# EAGLE design JeffreyBJT-optocoupler (EAGLE 6.4)
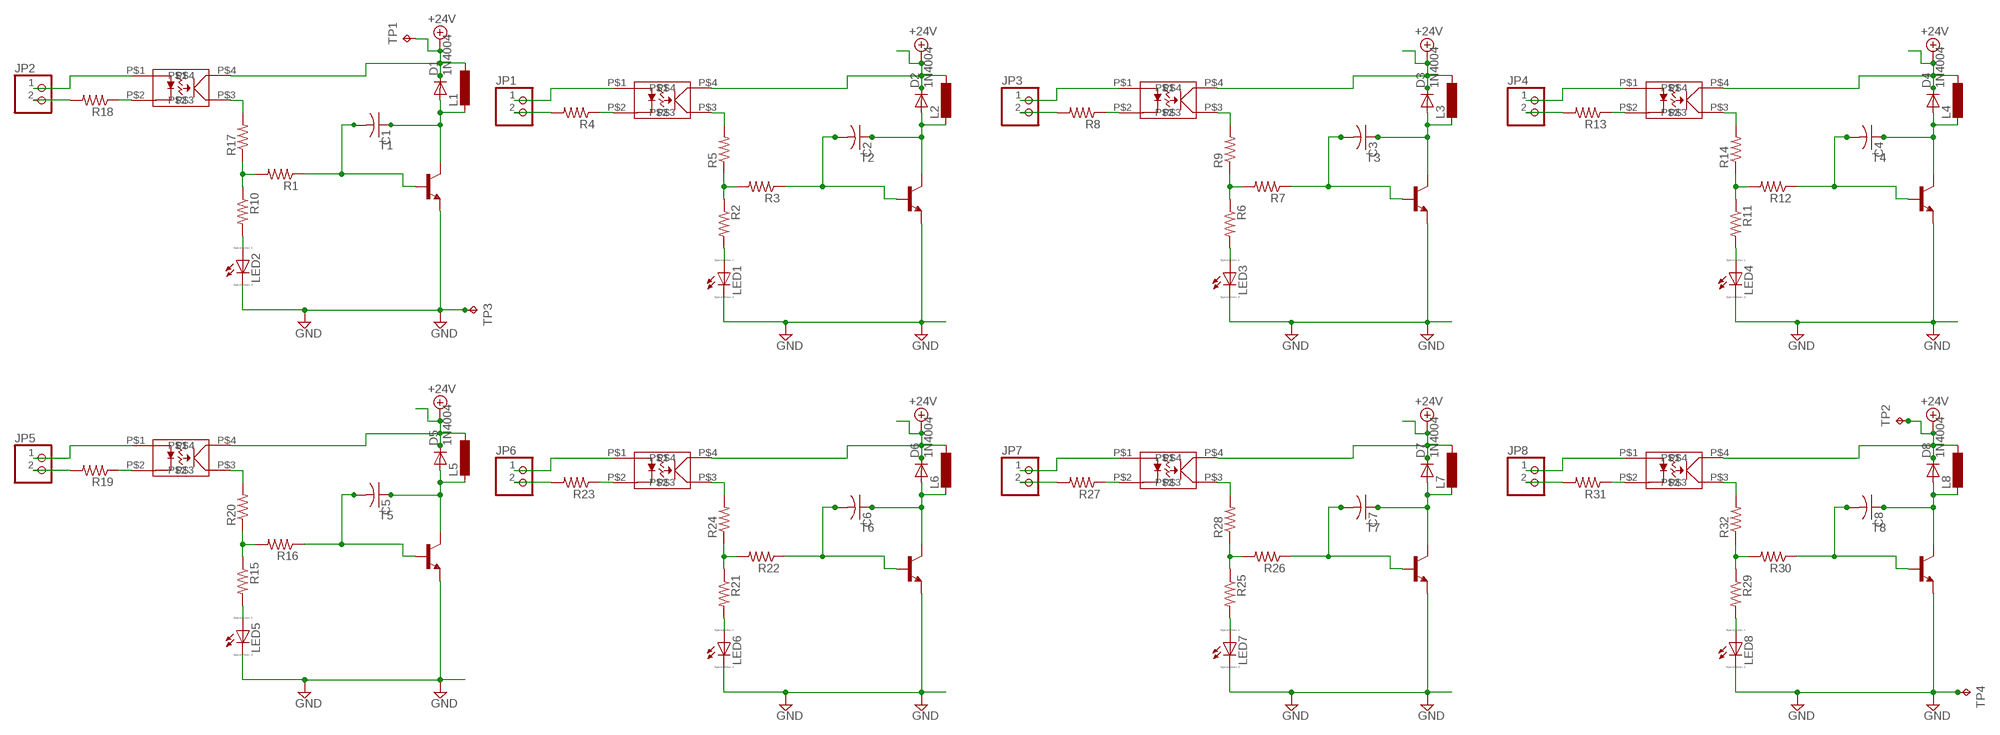
[diagram p0: schematic, sheet 1]

## Parts
C1  C-US050-024X044  [C050-024X044]
C2  C-US050-024X044  [C050-024X044]
C3  C-US050-024X044  [C050-024X044]
C4  C-US050-024X044  [C050-024X044]
C5  C-US050-024X044  [C050-024X044]
C6  C-US050-024X044  [C050-024X044]
C7  C-US050-024X044  [C050-024X044]
C8  C-US050-024X044  [C050-024X044]
D1  1N4004  [DO41-10]
D2  1N4004  [DO41-10]
D3  1N4004  [DO41-10]
D4  1N4004  [DO41-10]
D5  1N4004  [DO41-10]
D6  1N4004  [DO41-10]
D7  1N4004  [DO41-10]
D8  1N4004  [DO41-10]
JP1  PINHD-1X2  [1X02]
JP2  PINHD-1X2  [1X02]
JP3  PINHD-1X2  [1X02]
JP4  PINHD-1X2  [1X02]
JP5  PINHD-1X2  [1X02]
JP6  PINHD-1X2  [1X02]
JP7  PINHD-1X2  [1X02]
JP8  PINHD-1X2  [1X02]
L1  L-EU0207/10  [0207/10]
L2  L-EU0207/10  [0207/10]
L3  L-EU0207/10  [0207/10]
L4  L-EU0207/10  [0207/10]
L5  L-EU0207/10  [0207/10]
L6  L-EU0207/10  [0207/10]
L7  L-EU0207/10  [0207/10]
L8  L-EU0207/10  [0207/10]
LED1  LED_ELD260  [LED_LD260]
LED2  LED_ELD260  [LED_LD260]
LED3  LED_ELD260  [LED_LD260]
LED4  LED_ELD260  [LED_LD260]
LED5  LED_ELD260  [LED_LD260]
LED6  LED_ELD260  [LED_LD260]
LED7  LED_ELD260  [LED_LD260]
LED8  LED_ELD260  [LED_LD260]
R1  R-US_0207/2V  [0207/2V]
R2  R-US_0207/2V  [0207/2V]
R3  R-US_0207/2V  [0207/2V]
R4  R-US_0207/2V  [0207/2V]
R5  R-US_0207/7  [0207/7]
R6  R-US_0207/2V  [0207/2V]
R7  R-US_0207/2V  [0207/2V]
R8  R-US_0207/2V  [0207/2V]
R9  R-US_0207/7  [0207/7]
R10  R-US_0207/2V  [0207/2V]
R11  R-US_0207/2V  [0207/2V]
R12  R-US_0207/2V  [0207/2V]
R13  R-US_0207/2V  [0207/2V]
R14  R-US_0207/7  [0207/7]
R15  R-US_0207/2V  [0207/2V]
R16  R-US_0207/2V  [0207/2V]
R17  R-US_0207/7  [0207/7]
R18  R-US_0207/2V  [0207/2V]
R19  R-US_0207/2V  [0207/2V]
R20  R-US_0207/7  [0207/7]
R21  R-US_0207/2V  [0207/2V]
R22  R-US_0207/2V  [0207/2V]
R23  R-US_0207/2V  [0207/2V]
R24  R-US_0207/7  [0207/7]
R25  R-US_0207/2V  [0207/2V]
R26  R-US_0207/2V  [0207/2V]
R27  R-US_0207/2V  [0207/2V]
R28  R-US_0207/7  [0207/7]
R29  R-US_0207/2V  [0207/2V]
R30  R-US_0207/2V  [0207/2V]
R31  R-US_0207/2V  [0207/2V]
R32  R-US_0207/7  [0207/7]
T1  -NPN-TO220V  [TO220V]
T2  -NPN-TO220V  [TO220V]
T3  -NPN-TO220V  [TO220V]
T4  -NPN-TO220V  [TO220V]
T5  -NPN-TO220V  [TO220V]
T6  -NPN-TO220V  [TO220V]
T7  -NPN-TO220V  [TO220V]
T8  -NPN-TO220V  [TO220V]
TP1  TPPAD1-13Y  [P1-13Y]
TP2  TPPAD1-13Y  [P1-13Y]
TP3  TPPAD1-13Y  [P1-13Y]
TP4  TPPAD1-13Y  [P1-13Y]
U$1  PS2501_TRU  [PS2501_TRU]
U$2  PS2501_TRU  [PS2501_TRU]
U$3  PS2501_TRU  [PS2501_TRU]
U$4  PS2501_TRU  [PS2501_TRU]
U$5  PS2501_TRU  [PS2501_TRU]
U$6  PS2501_TRU  [PS2501_TRU]
U$7  PS2501_TRU  [PS2501_TRU]
U$8  PS2501_TRU  [PS2501_TRU]

## Nets
+24V [SUPPLY]: D1.C D2.C D3.C D4.C D5.C D6.C D7.C D8.C L1.1 L2.1 L3.1 L4.1 L5.1 L6.1 L7.1 L8.1 TP1.TP TP2.TP U$1.P$4 U$2.P$4 U$3.P$4 U$4.P$4 U$5.P$4 U$6.P$4 U$7.P$4 U$8.P$4
GND [GND]: LED1.K(C) LED2.K(C) LED3.K(C) LED4.K(C) LED5.K(C) LED6.K(C) LED7.K(C) LED8.K(C) T1.3(E) T2.3(E) T3.3(E) T4.3(E) T5.3(E) T6.3(E) T7.3(E) T8.3(E) TP3.TP TP4.TP
N$1: C1.1 D1.A L1.2 T1.2(C)
N$2: C1.2 R1.1 T1.1(B)
N$3: R1.2 R10.1 R17.1
N$4: C2.1 D2.A L2.2 T2.2(C)
N$6: C2.2 R3.1 T2.1(B)
N$7: R2.1 R3.2 R5.1
N$9: R5.2 U$2.P$3
N$10: R4.1 U$2.P$2
N$11: JP1.2 R4.2
N$12: JP1.1 U$2.P$1
N$13: LED1.A R2.2
N$14: C3.1 D3.A L3.2 T3.2(C)
N$15: C3.2 R7.1 T3.1(B)
N$16: R6.1 R7.2 R9.1
N$18: R9.2 U$3.P$3
N$19: R8.1 U$3.P$2
N$20: JP3.2 R8.2
N$21: JP3.1 U$3.P$1
N$22: LED3.A R6.2
N$23: C4.1 D4.A L4.2 T4.2(C)
N$24: C4.2 R12.1 T4.1(B)
N$25: R11.1 R12.2 R14.1
N$26: LED2.A R10.2
N$28: R14.2 U$4.P$3
N$29: R13.1 U$4.P$2
N$30: R17.2 U$1.P$3
N$31: JP2.2 R18.2
N$32: JP4.2 R13.2
N$33: JP2.1 U$1.P$1
N$34: JP4.1 U$4.P$1
N$35: R18.1 U$1.P$2
N$36: LED4.A R11.2
N$37: C5.1 D5.A L5.2 T5.2(C)
N$38: C5.2 R16.1 T5.1(B)
N$39: R15.1 R16.2 R20.1
N$41: R20.2 U$5.P$3
N$42: R19.1 U$5.P$2
N$43: JP5.2 R19.2
N$44: JP5.1 U$5.P$1
N$45: LED5.A R15.2
N$46: C6.1 D6.A L6.2 T6.2(C)
N$47: C6.2 R22.1 T6.1(B)
N$48: R21.1 R22.2 R24.1
N$50: R24.2 U$6.P$3
N$51: R23.1 U$6.P$2
N$52: JP6.2 R23.2
N$53: JP6.1 U$6.P$1
N$54: LED6.A R21.2
N$55: C7.1 D7.A L7.2 T7.2(C)
N$56: C7.2 R26.1 T7.1(B)
N$57: R25.1 R26.2 R28.1
N$59: R28.2 U$7.P$3
N$60: R27.1 U$7.P$2
N$61: JP7.2 R27.2
N$62: JP7.1 U$7.P$1
N$63: LED7.A R25.2
N$64: C8.1 D8.A L8.2 T8.2(C)
N$65: C8.2 R30.1 T8.1(B)
N$66: R29.1 R30.2 R32.1
N$68: R32.2 U$8.P$3
N$69: R31.1 U$8.P$2
N$70: JP8.2 R31.2
N$71: JP8.1 U$8.P$1
N$72: LED8.A R29.2

## Library data of the parts
C1-C8 = rcl:C-US: CAPACITOR, American symbol
D1-D8 = diode:1N4004: DIODE general purpose rectifier, 1 A
JP1-JP8 = pinhead:PINHD-1X2: PIN HEADER
L1-L8 = rcl:L-EU: INDUCTOR, European symbol
LED1-LED8 = eagle-ltspice:LED_E: LED Source: http://www.osram.convergy.de Source: www.luxeon.com Source: www.kingbright.com; SPICEMODEL: NONE; SPICEPREFIX: D; SPICETYPE: diode
R1-R32 = rcl:R-US_: RESISTOR, American symbol
T1-T8 = transistor:*-NPN-: NPN Transistror BF959 corrected 2008.03.06
TP1-TP4 = testpad:TP: Test pad
U$1-U$8 = OpticalCoupler:PS2501_TRU

## Net classes
2 GND: width 1.143 mm
3 SUPPLY: width 1.143 mm

## Board
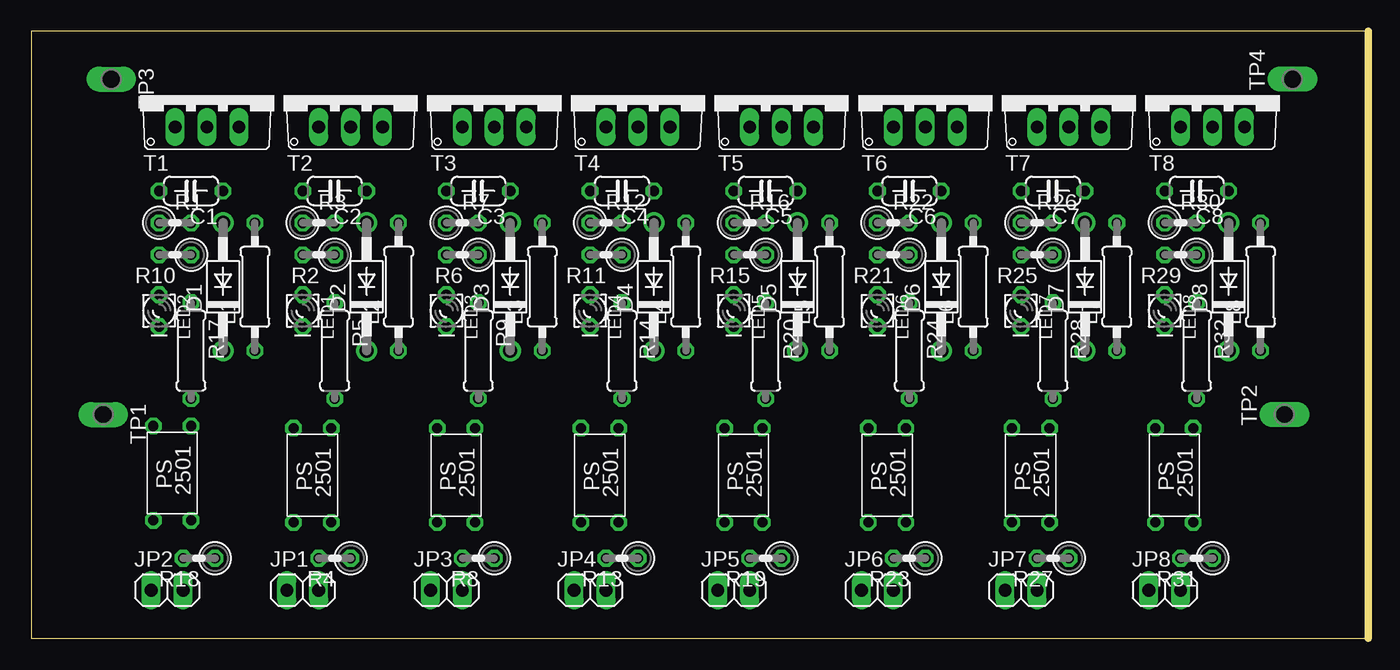
[diagram p1: board, top side]
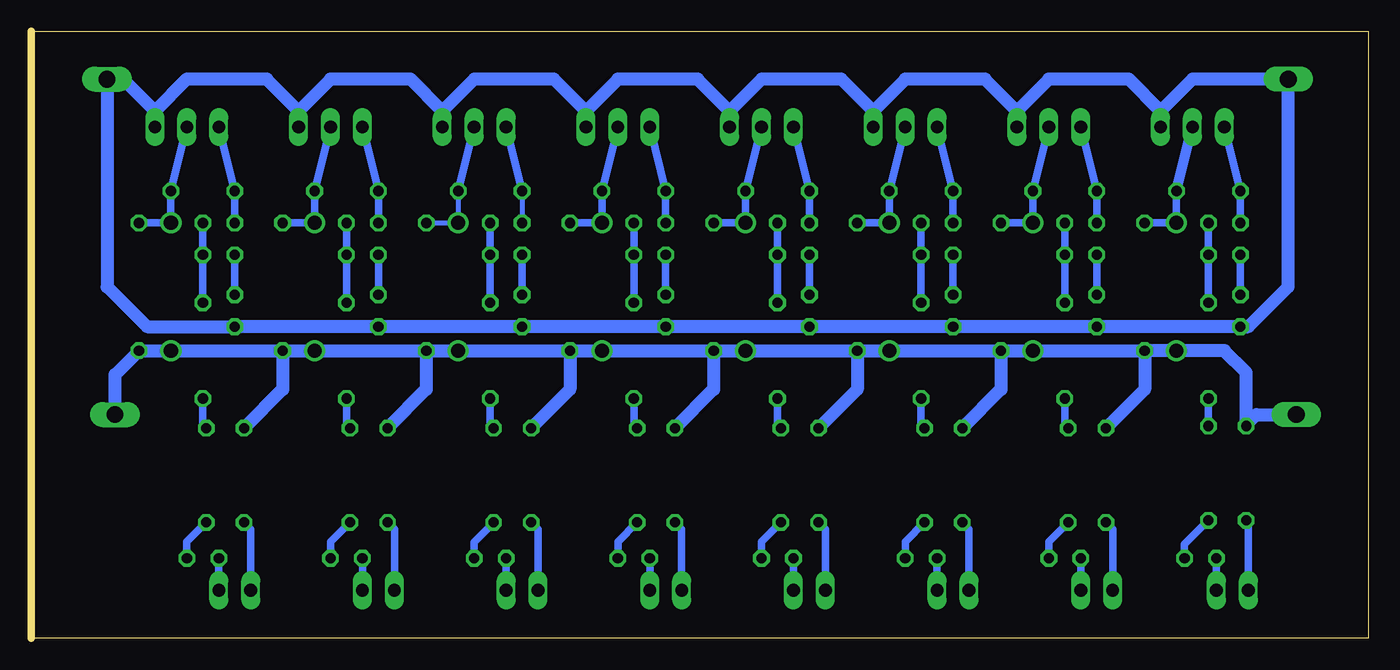
[diagram p2: board, bottom side, seen from below]

Size 106.35 x 48.25 mm. Coordinates in mm from the lower left corner, seen from the top.
Outline: 0,0 106.35,0 106.35,48.25 0,48.25 0,0
Copper layers (1*16): Top 0.035mm / dielectric 1.5mm / Bottom 0.035mm
Design rules "default": minimum track width 10mil, minimum drill 24mil, track to track 8mil, track to pad 8mil, pad to pad 8mil, via to via 8mil, smd to smd 8mil, copper to edge 40mil, drill to drill 8mil, minimum pad ring 10mil, minimum via ring 8mil, stop-mask expansion 4mil, vias tented up to drill 0mil, thermal gap 10mil

### Footprints (pad centres in the part's own frame; a part is rotated, then mirrored left to right if it is on the bottom)
C050-024X044 = drill 0.813 octagon: 1 -2.54,0; 2 2.54,0
DO41-10 = drill 1.118: A 5.08,0; C -5.08,0
1X02 = drill 1.016 long: 1 -1.27,0; 2 1.27,0
0207/10 = drill 0.813 octagon: 1 -5.08,0; 2 5.08,0
LED_LD260 = drill 0.813 octagon: A -1.27,0; K 1.27,0
0207/2V = drill 0.813 octagon: 1 -1.27,0; 2 1.27,0
0207/7 = drill 0.813 octagon: 1 -3.81,0; 2 3.81,0
TO220V = drill 1.016 long: 1 -2.54,-2.54; 2 0,-2.54; 3 2.54,-2.54
P1-13Y = drill 1.321 pad 1.905 long: TP 0,0
PS2501_TRU = drill 0.8 octagon: P$1 -3.5,2; P$2 -3.5,-1; P$3 4,-1; P$4 4,2

### Placement (x,y rotation side)
C1  12.7,35.56 180 top
C2  24.13,35.56 180 top
C3  35.56,35.56 180 top
C4  46.99,35.56 180 top
C5  58.42,35.56 180 top
C6  69.85,35.56 180 top
C7  81.28,35.56 180 top
C8  92.71,35.56 180 top
D1  15.24,27.94 90 top
D2  26.67,27.94 90 top
D3  38.1,27.94 90 top
D4  49.53,27.94 90 top
D5  60.96,27.94 90 top
D6  72.39,27.94 90 top
D7  83.82,27.94 90 top
D8  95.25,27.94 90 top
JP1  21.59,3.81 0 top
JP2  10.79,3.81 0 top
JP3  33.02,3.81 0 top
JP4  44.45,3.81 0 top
JP5  55.88,3.81 0 top
JP6  67.31,3.81 0 top
JP7  78.74,3.81 0 top
JP8  90.17,3.81 0 top
L1  17.78,27.94 90 top
L2  29.21,27.94 90 top
L3  40.64,27.94 90 top
L4  52.07,27.94 90 top
L5  63.5,27.94 90 top
L6  74.93,27.94 90 top
L7  86.36,27.94 90 top
L8  97.79,27.94 90 top
LED1  21.59,26.04 270 top
LED2  10.16,26.04 270 top
LED3  33.02,26.04 270 top
LED4  44.45,26.04 270 top
LED5  55.88,26.04 270 top
LED6  67.31,26.04 270 top
LED7  78.74,26.04 270 top
LED8  90.17,26.04 270 top
R1  11.43,33.02 0 top
R2  22.86,30.48 180 top
R3  22.86,33.02 0 top
R4  24.13,6.35 180 top
R5  24.13,22.86 270 top
R6  34.29,30.48 180 top
R7  34.29,33.02 0 top
R8  35.56,6.35 180 top
R9  35.56,22.86 270 top
R10  11.43,30.48 180 top
R11  45.72,30.48 180 top
R12  45.72,33.02 0 top
R13  46.99,6.35 180 top
R14  46.99,22.86 270 top
R15  57.15,30.48 180 top
R16  57.15,33.02 0 top
R17  12.7,22.86 270 top
R18  13.34,6.35 180 top
R19  58.42,6.35 180 top
R20  58.42,22.86 270 top
R21  68.58,30.48 180 top
R22  68.58,33.02 0 top
R23  69.85,6.35 180 top
R24  69.85,22.86 270 top
R25  80.01,30.48 180 top
R26  80.01,33.02 0 top
R27  81.28,6.35 180 top
R28  81.28,22.86 270 top
R29  91.44,30.48 180 top
R30  91.44,33.02 0 top
R31  92.71,6.35 180 top
R32  92.71,22.86 270 top
T1  13.97,43.18 0 top
T2  25.4,43.18 0 top
T3  36.83,43.18 0 top
T4  48.26,43.18 0 top
T5  59.69,43.18 0 top
T6  71.12,43.18 0 top
T7  82.55,43.18 0 top
T8  93.98,43.18 0 top
TP1  5.71,17.78 270 top
TP2  99.69,17.78 90 top
TP3  6.35,44.45 270 top
TP4  100.33,44.45 90 top
U$1  11.7,12.87 90 top
U$2  22.86,12.7 90 top
U$3  34.29,12.7 90 top
U$4  45.72,12.7 90 top
U$5  57.15,12.7 90 top
U$6  68.58,12.7 90 top
U$7  80.01,12.7 90 top
U$8  91.44,12.7 90 top

### Tracks (layer width: path | path; a pad name or v marks a point on that pad's centre or on a via)
+24V
  Bottom 0.406: U$1.P$4 9.71,16.96
  Bottom 1.016: L1.1 D1.C 11.43,22.86 9.71,21.14 U$1.P$4 | L7.1 D8.C L8.1 99.69,20.95 TP2.TP | L7.1 D7.C L6.1 | L6.1 D6.C L5.1 | L5.1 D5.C L4.1 | L4.1 D4.C L3.1 | L3.1 D3.C L2.1 | L2.1 D2.C L1.1 | L1.1 17.78,19.78 U$2.P$4 | L2.1 29.21,19.78 U$3.P$4 | L3.1 40.64,19.78 U$4.P$4 | L6.1 74.93,19.78 U$7.P$4 | L4.1 52.07,19.78 U$5.P$4 | L5.1 63.5,19.78 U$6.P$4 | L7.1 86.36,19.78 U$8.P$4 | 9.71,16.96 8.89,17.78 TP1.TP
GND
  Bottom 0.406: T1.3 16.51,41.91 | T2.3 27.94,41.91
  Bottom 1.016: 39.37,41.91 36.83,44.45 30.48,44.45 27.94,41.91 25.4,44.45 19.05,44.45 16.51,41.91 13.97,44.45 TP3.TP 6.35,27.94 9.53,24.77 LED2.K LED1.K LED3.K LED4.K LED5.K LED6.K LED7.K LED8.K 97.16,24.77 100.33,27.94 TP4.TP | T3.3 39.37,41.91 | 39.37,41.91 41.91,44.45 48.26,44.45 50.8,41.91 | T4.3 50.8,41.91 | 50.8,41.91 53.34,44.45 59.69,44.45 62.23,41.91 | T5.3 62.23,41.91 | 62.23,41.91 64.77,44.45 71.12,44.45 73.66,41.91 | T6.3 73.66,41.91 | 73.66,41.91 76.2,44.45 82.55,44.45 85.09,41.91 | T7.3 85.09,41.91 | 85.09,41.91 87.63,44.45 93.98,44.45 96.52,41.91 | 96.52,41.91 T8.3 | 99.06,44.45 96.52,41.91
N$1
  Bottom 0.61: C1.1 D1.A L1.2
  Bottom 0.813: C1.1 T1.2
N$2
  Bottom 0.61: T1.1 C1.2 R1.1
N$3
  Bottom 0.61: R1.2 R10.1 R17.1
N$4
  Bottom 0.61: T2.2 C2.1 D2.A L2.2
N$6
  Bottom 0.61: T2.1 C2.2 R3.1
N$7
  Bottom 0.61: R3.2 R2.1 R5.1
N$9
  Bottom 0.61: R5.2 24.13,16.97 U$2.P$3
N$10
  Bottom 0.61: R4.1 25.4,7.66 U$2.P$2
N$11
  Bottom 0.61: R4.2 JP1.2
N$12
  Bottom 0.61: JP1.1 20.32,8.66 U$2.P$1
N$13
  Bottom 0.61: R2.2 LED1.A
N$14
  Bottom 0.61: T3.2 C3.1 D3.A L3.2
N$15
  Bottom 0.61: T3.1 C3.2 R7.1
N$16
  Bottom 0.61: R7.2 R6.1 R9.1
N$18
  Bottom 0.61: R9.2 35.56,16.97 U$3.P$3
N$19
  Bottom 0.61: R8.1 36.83,7.66 U$3.P$2
N$20
  Bottom 0.61: R8.2 JP3.2
N$21
  Bottom 0.61: JP3.1 31.75,8.66 U$3.P$1
N$22
  Bottom 0.61: R6.2 LED3.A
N$23
  Bottom 0.61: T4.2 C4.1 D4.A L4.2
N$24
  Bottom 0.61: T4.1 C4.2 R12.1
N$25
  Bottom 0.61: R12.2 R11.1 R14.1
N$26
  Bottom 0.61: R10.2 LED2.A
N$28
  Bottom 0.61: R14.2 46.99,16.97 U$4.P$3
N$29
  Bottom 0.61: R13.1 48.26,7.66 U$4.P$2
N$30
  Bottom 0.406: R17.2
  Bottom 0.61: U$1.P$3 R17.2
N$31
  Bottom 0.61: R18.2 JP2.2
N$32
  Bottom 0.61: R13.2 JP4.2
N$33
  Bottom 0.61: JP2.1 9.53,9.19 U$1.P$1
N$34
  Bottom 0.61: JP4.1 43.18,8.66 U$4.P$1
N$35
  Bottom 0.61: R18.1 14.61,7.47 U$1.P$2
N$36
  Bottom 0.61: R11.2 LED4.A
N$37
  Bottom 0.61: T5.2 C5.1 D5.A L5.2
N$38
  Bottom 0.61: T5.1 C5.2 R16.1
N$39
  Bottom 0.61: R16.2 R15.1 R20.1
N$41
  Bottom 0.61: R20.2 58.42,16.97 U$5.P$3
N$42
  Bottom 0.61: R19.1 59.69,7.66 U$5.P$2
N$43
  Bottom 0.61: R19.2 JP5.2
N$44
  Bottom 0.61: JP5.1 54.61,8.66 U$5.P$1
N$45
  Bottom 0.61: LED5.A R15.2
N$46
  Bottom 0.406: C6.1 D6.A L6.2
  Bottom 0.61: T6.2 C6.1
N$47
  Bottom 0.406: C6.2 R22.1
  Bottom 0.61: T6.1 C6.2
N$48
  Bottom 0.61: R24.1 R21.1 R22.2
N$50
  Bottom 0.61: R24.2 69.85,16.97 U$6.P$3
N$51
  Bottom 0.406: 69.85,8.89 69.85,8.93 U$6.P$2
  Bottom 0.61: R23.1 71.12,7.62 69.85,8.89
N$52
  Bottom 0.406: 68.58,2.54 JP6.2
  Bottom 0.61: R23.2 JP6.2
N$53
  Bottom 0.61: JP6.1 66.04,8.66 U$6.P$1
N$54
  Bottom 0.61: R21.2 LED6.A
N$55
  Bottom 0.61: T7.2 C7.1 D7.A L7.2
N$56
  Bottom 0.61: T7.1 C7.2 R26.1
N$57
  Bottom 0.61: R26.2 R25.1 R28.1
N$59
  Bottom 0.61: R28.2 81.28,16.97 U$7.P$3
N$60
  Bottom 0.61: R27.1 82.55,7.66 U$7.P$2
N$61
  Bottom 0.61: R27.2 JP7.2
N$62
  Bottom 0.61: JP7.1 77.47,8.66 U$7.P$1
N$63
  Bottom 0.61: R25.2 LED7.A
N$64
  Bottom 0.61: T8.2 C8.1 D8.A L8.2
N$65
  Bottom 0.61: T8.1 C8.2 R30.1
N$66
  Bottom 0.61: R30.2 R29.1 R32.1
N$68
  Bottom 0.61: R32.2 92.71,16.97 U$8.P$3
N$69
  Bottom 0.61: R31.1 93.98,7.66 U$8.P$2
N$70
  Bottom 0.61: R31.2 JP8.2
N$71
  Bottom 0.61: JP8.1 88.9,8.66 U$8.P$1
N$72
  Bottom 0.61: R29.2 LED8.A